# EAGLE design SI1120-sensor (EAGLE 5.06)
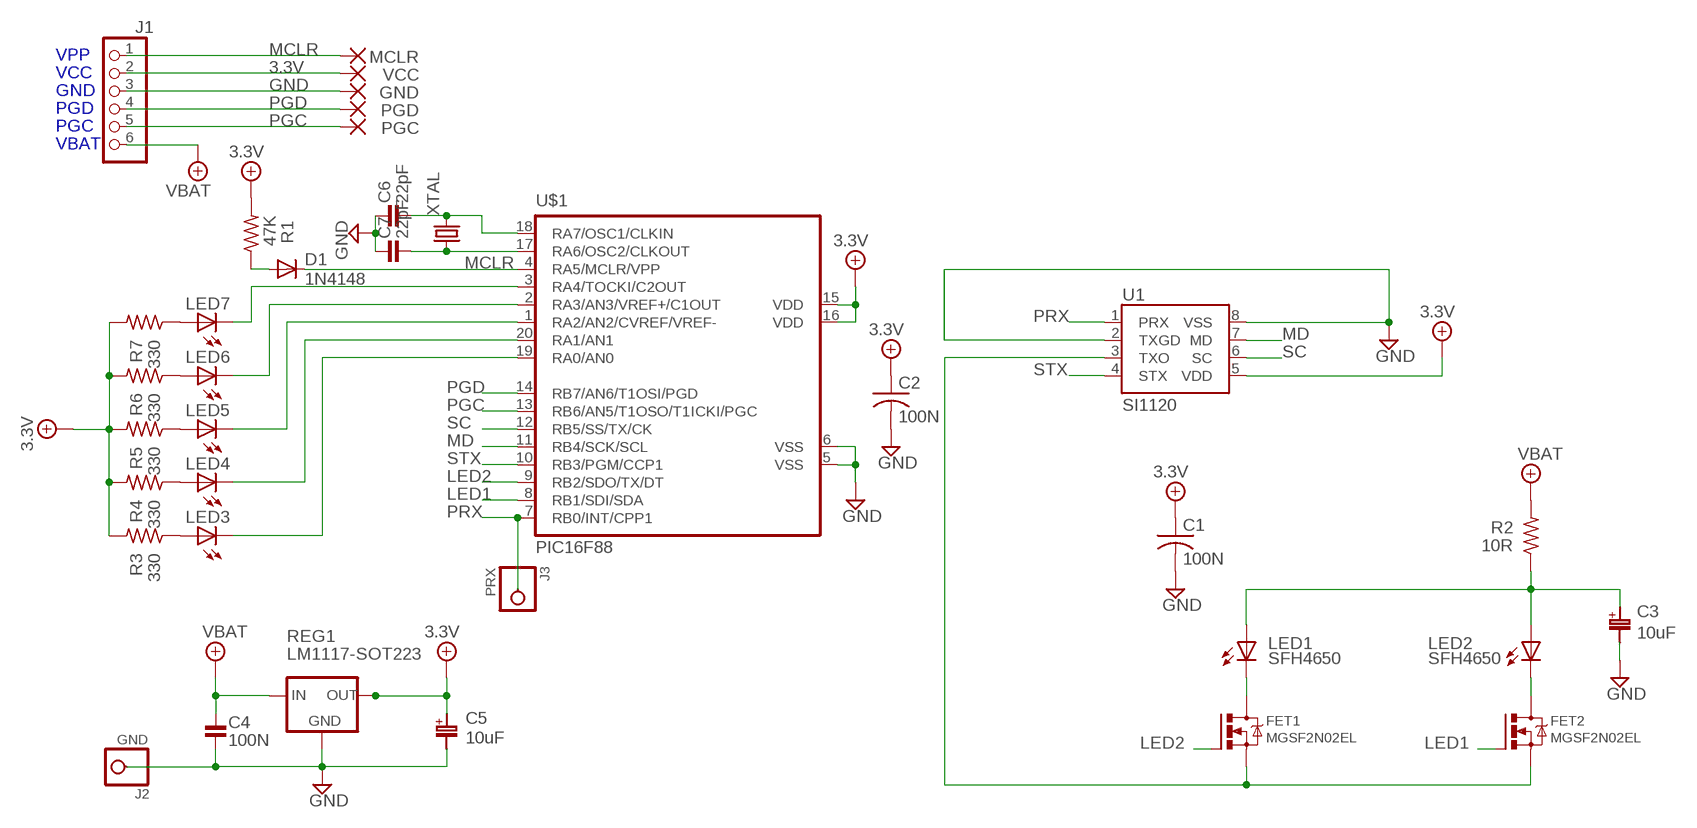
[diagram p0: schematic, sheet 1]

## Parts
C1  100N  C-US050-025X075  [C050-025X075]
C2  100N  C-USC0805  [C0805]
C3  10uF  CAP_POLCT3528-21  [3528-21R]
C4  100N  C-SMD0805  [R0805-AMR]
C5  10uF  CAP_POLCT3528-21  [3528-21R]
C6  22pF  C-SMD0805  [R0805-AMR]
C7  22pF  C-SMD0805  [R0805-AMR]
D1  1N4148  1N4148DO35-7  [DO35-7]
FET1  MGSF2N02EL  [SOT-23-3]
FET2  MGSF2N02EL  [SOT-23-3]
GND  SMD2  [SMD1,27-2,54]
J1  PINHD-1X6  [1X06]
J2  GND  PINHD-1X1  [1X01]
J3  PRX  PINHD-1X1  [1X01]
LED1  SFH4650  [SFH4650]
LED2  SFH4650  [SFH4650]
LED3  LED5MM  [LED5MM]
LED4  LED5MM  [LED5MM]
LED5  LED5MM  [LED5MM]
LED6  LED5MM  [LED5MM]
LED7  LED5MM  [LED5MM]
MCLR  SMD2  [SMD1,27-2,54]
PGC  SMD2  [SMD1,27-2,54]
PGD  SMD2  [SMD1,27-2,54]
R1  47K  R-US_0207/7  [0207/7]
R2  10R  R-SMD0805  [R0805-AMR]
R3  330  R-US_0207/7  [0207/7]
R4  330  R-US_0207/7  [0207/7]
R5  330  R-US_0207/7  [0207/7]
R6  330  R-US_0207/7  [0207/7]
R7  330  R-US_0207/7  [0207/7]
REG1  LM1117-SOT223  [SOT223]
U1  SI1120  [ODFN8-M]
U$1  PIC16F88  [SSOP20]
VCC  SMD2  [SMD1,27-2,54]
XTAL  CRYSTALHC49S  [HC49/S]

## Nets
3.3V [power]: C1.1 C2.1 C5.+ J1.2 R1.2 R3.2 R4.2 R5.2 R6.2 R7.2 REG1.2(OUT) REG1.4(TAB) U1.5(VDD) U$1.15(VDD) U$1.16(VDD) VCC.1(P)
GND [power]: C1.2 C2.2 C3.- C4.2 C5.- C6.1 C7.1 GND.1(P) J1.3 J2.1 REG1.1(GND) U1.2(TXGD) U1.8(VSS) U$1.5(VSS) U$1.6(VSS)
LED1: FET2.1(G) U$1.8(RB1/SDI/SDA)
LED2: FET1.1(G) U$1.9(RB2/SDO/TX/DT)
MCLR: D1.C J1.1 MCLR.1(P) U$1.4(RA5/MCLR/VPP)
MD: U1.7(MD) U$1.11(RB4/SCK/SCL)
N$1: FET1.3(D) LED1.K(C)
N$2: FET2.3(D) LED2.K(C)
N$3 [power]: C3.+ LED1.A LED2.A R2.1
N$4: LED7.A R7.1
N$5: LED6.A R6.1
N$6 [power]: FET1.2(S) FET2.2(S) U1.3(TXO)
N$7: LED5.A R5.1
N$8: LED4.A R4.1
N$9: LED3.A R3.1
N$10: LED7.K(C) U$1.3(RA4/TOCKI/C2OUT)
N$11: D1.A R1.1
N$12: LED6.K(C) U$1.2(RA3/AN3/VREF+/C1OUT)
N$13: LED5.K(C) U$1.1(RA2/AN2/CVREF/VREF-)
N$14: LED4.K(C) U$1.20(RA1/AN1)
N$15: LED3.K(C) U$1.19(RA0/AN0)
N$16: C6.2 U$1.18(RA7/OSC1/CLKIN) XTAL.2
N$17: C7.2 U$1.17(RA6/OSC2/CLKOUT) XTAL.1
PGC: J1.5 PGC.1(P) U$1.13(RB6/AN5/T1OSO/T1ICKI/PGC)
PGD: J1.4 PGD.1(P) U$1.14(RB7/AN6/T1OSI/PGD)
PRX: J3.1 U1.1(PRX) U$1.7(RB0/INT/CPP1)
SC: U1.6(SC) U$1.12(RB5/SS/TX/CK)
STX: U1.4(STX) U$1.10(RB3/PGM/CCP1)
VBAT [power]: C4.1 J1.6 R2.2 REG1.3(IN)

## Notes on the sheet
- VPP
- VCC
- GND
- PGD
- PGC
- VBAT

## Library data of the parts
C1 C2 = rcl:C-US: CAPACITOR, American symbol
C3 C5 = aaron_discrete:CAP_POL
C4 C6 C7 = aaron_discrete:C-SMD: SMD non-polarized capacitor library - AMR
D1 = diode:1N4148: DIODE high speed (Philips)
FET1 FET2 = aaron_discrete:MGSF2N02EL
GND MCLR PGC PGD VCC = wirepad:SMD2: SMD PAD
J1 = aaron_hardware:PINHD-1X6: PIN HEADER
J2 J3 = aaron_hardware:PINHD-1X1
LED1 LED2 = aaron_discrete:SFH4650
LED3-LED7 = aaron_discrete:LED
R1 R3-R7 = resistor:R-US_: RESISTOR, American symbol
R2 = aaron_discrete:R-SMD: SMD Resistor library, AMR
REG1 = aaron_discrete:LM1117-SOT223
U1 = aaron_ic:SI1120: IR/LIGHT SENSOR AMBIENT W/PWM OUT
U$1 = microchip:PIC16F88: FLASH-Based 8-Bit CMOS Microcontroller
XTAL = crystal:CRYSTAL: CRYSTAL

## Net classes
0 default: width 0.152 mm, drill 0.3 mm, clearance 0.152 mm
1 power: width 0.254 mm, drill 0.3 mm, clearance 0.152 mm

## Board
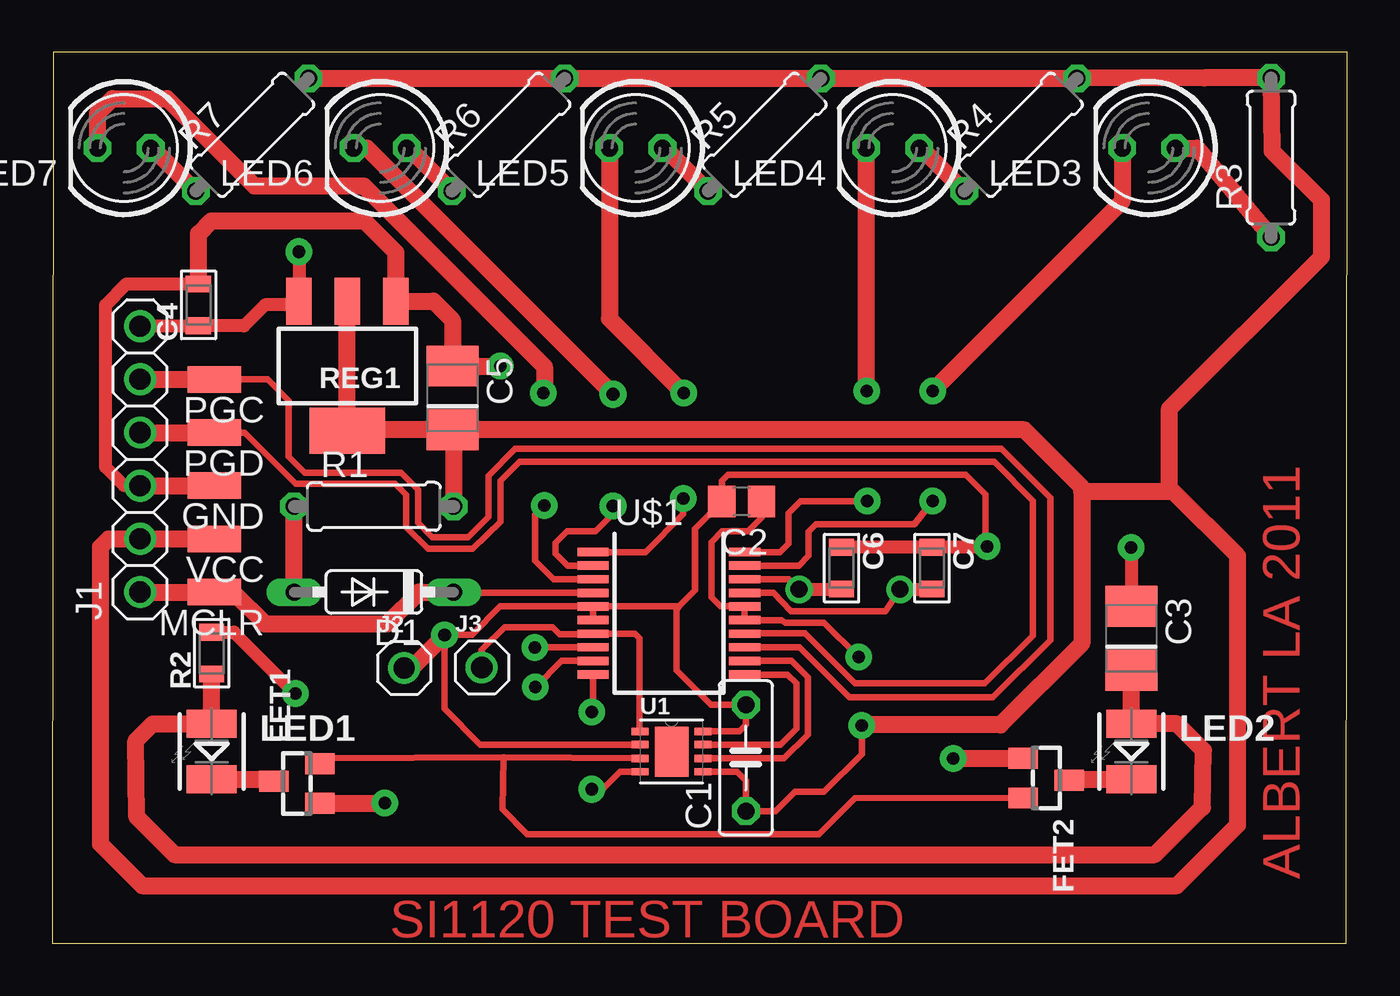
[diagram p1: board, top side]
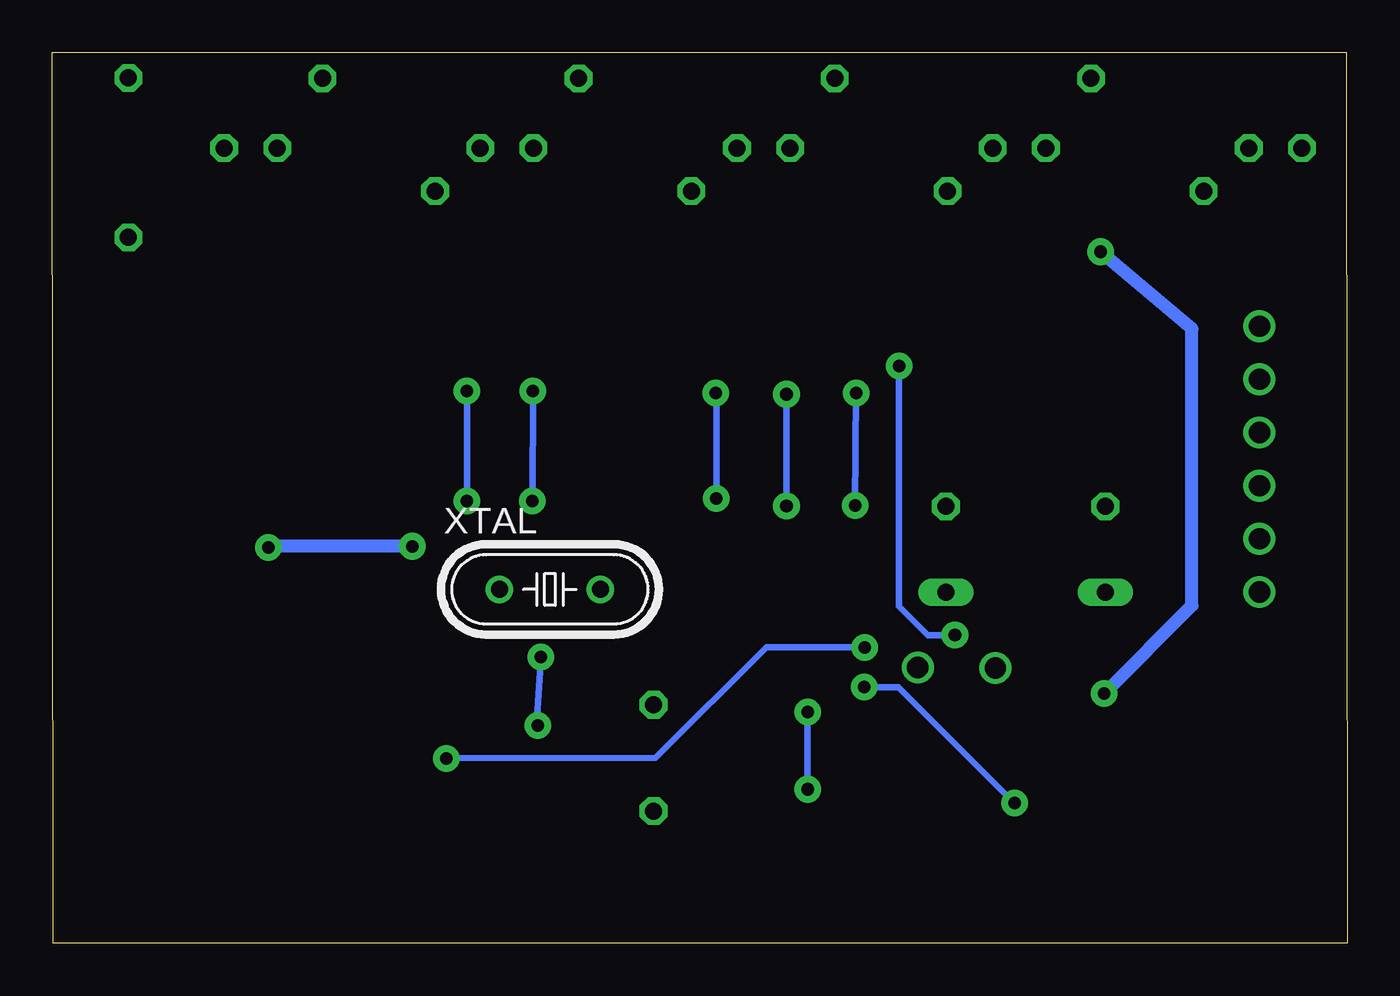
[diagram p2: board, bottom side, seen from below]

Size 61.88 x 42.57 mm. Coordinates in mm from the lower left corner, seen from the top.
Outline: 0,0 61.83,0 61.88,42.57 0.05,42.57 0,0
Copper layers (1*16): Top 0.035mm / dielectric 1.5mm / Bottom 0.035mm
Design rules "default": minimum track width 10mil, minimum drill 24mil, track to track 8mil, track to pad 8mil, pad to pad 8mil, via to via 8mil, smd to smd 8mil, copper to edge 40mil, drill to drill 8mil, minimum pad ring 10mil, minimum via ring 8mil, stop-mask expansion 4mil, vias tented up to drill 0mil, thermal gap 10mil

### Footprints (pad centres in the part's own frame; a part is rotated, then mirrored left to right if it is on the bottom)
C050-025X075 = drill 0.813 octagon: 1 -2.54,0; 2 2.54,0
C0805 = smd 1.3 x 1.5: 1 -0.95,0; 2 0.95,0
3528-21R = smd 1.95 x 2.5: + 1.525,0; - -1.525,0
R0805-AMR = smd 0.8 x 1.2: 1 -1,0; 2 1,0
DO35-7 = drill 0.813 long: A 3.81,0; C -3.81,0
SOT-23-3 = smd 1 x 1.4: 1 -0.95,-1.1; 2 0.95,-1.1; 3 0.1,1.1
SMD1,27-2,54 = smd 1.27 x 2.54: 1 0,0
1X06 = drill 1.016 round: 1 -6.35,0; 2 -3.81,0; 3 -1.27,0; 4 1.27,0; 5 3.81,0; 6 6.35,0
1X01 = drill 1.016 round: 1 0,0
SFH4650 = smd 2.4 x 1.35: A 0,1.325; K 0,-1.325
LED5MM = drill 0.813 octagon: A -1.27,0; K 1.27,0
0207/7 = drill 0.813 octagon: 1 -3.81,0; 2 3.81,0
SOT223 = smd 1.219 x 2.235: 1 -2.311,-3.099; 2 0,-3.099; 3 2.311,-3.099 | smd 3.6 x 2.2: 4 0,3.099
ODFN8-M = smd 0.813 x 0.356: 1 -1.499,0.965; 2 -1.499,0.33; 3 -1.499,-0.33; 4 -1.499,-0.965; 5 1.499,-0.965; 6 1.499,-0.33; 7 1.499,0.33; 8 1.499,0.965 | smd 1.6 x 2.388: 9 0,0
SSOP20 = smd 0.4 x 1.5: 1 -2.925,-3.625; 2 -2.275,-3.625; 3 -1.625,-3.625; 4 -0.975,-3.625; 5 -0.325,-3.625; 6 0.325,-3.625; 7 0.975,-3.625; 8 1.625,-3.625; 9 2.275,-3.625; 10 2.925,-3.625; 11 2.925,3.625; 12 2.275,3.625; 13 1.625,3.625; 14 0.975,3.625; 15 0.325,3.625; 16 -0.325,3.625; 17 -0.975,3.625; 18 -1.625,3.625; 19 -2.275,3.625; 20 -2.925,3.625
HC49/S = drill 0.813 round: 1 -2.413,0; 2 2.413,0

### Placement (x,y rotation side)
C1  33.15,8.86 90 top
C2  32.94,21.11 180 top
C3  51.56,14.58 270 top
C4  6.98,30.51 90 top
C5  19.13,26.06 270 top
C6  37.72,17.93 270 top
C7  42.04,17.93 270 top
D1  15.37,16.79 180 top
FET1  11.68,7.65 90 top
FET2  47.5,7.9 270 top
GND  7.75,21.87 90 top
J1  4.19,23.14 90 top
J2  16.81,13.16 0 top
J3  20.52,13.18 0 top
LED1  7.62,9.17 0 top
LED2  51.56,9.17 0 top
LED3  52.4,38 180 top
LED4  40.16,38 180 top
LED5  27.89,38 180 top
LED6  15.67,38 180 top
LED7  3.43,38 180 top
MCLR  7.75,16.79 90 top
PGC  7.75,26.95 90 top
PGD  7.75,24.41 90 top
R1  15.37,20.88 0 top
R2  7.62,13.87 90 top
R3  58.24,37.54 90 top
R4  46.28,38.63 45 top
R5  34.04,38.63 45 top
R6  21.79,38.63 45 top
R7  9.55,38.63 45 top
REG1  14.1,27.58 180 top
U1  29.59,9.17 0 top
U$1  29.46,15.77 270 top
VCC  7.75,19.33 90 top
XTAL  38.1,16.92 0 bottom

### Tracks (layer width: path | path; a pad name or v marks a point on that pad's centre or on a via)
3.3V  (via drill 0.6 pad 1.27)
  Top 0.305: U1.5 32.72,8.2 33.15,7.77 C1.1 34.57,6.32 35.48,7.24 36.88,7.24 38.68,9.04 v38.68,10.41 | C2.1 33.89,20.33 33.25,19.69 32,19.69 31.5,19.18 31.5,16.54 31.93,16.1 U$1.16 U$1.15 34.46,15.45 34.77,15.44 34.85,15.44 35.03,15.32 36.88,15.32 v38.53,13.69
  Top 0.813: REG1.2 REG1.4 14.15,24.54 C5.+ | C5.+ 46.46,24.54 49.2,21.79 49.2,21.59 | 49.2,21.59 49.2,14.33 45.31,10.44 38.71,10.44 v38.68,10.41 | R1.2 19.18,24.15 C5.+ | 53.32,21.59 53.57,21.59 56.64,18.52 56.64,5.66 53.75,2.77 4.29,2.77 2.31,4.75 2.31,18.95 2.69,19.33 J1.2 VCC.1 | 53.32,21.59 49.2,21.59 | 53.32,21.59 53.39,21.67 53.39,25.55 60.66,32.82 60.66,35.51 58.29,37.85 R3.2 55.04,41.35 R4.2 R5.2 R6.2 R7.2
  Bottom 0.305: v38.53,13.69 38.73,10.46 v38.68,10.41
GND  (via drill 0.6 pad 1.27)
  Top 0.305: U$1.5 U$1.6 | U1.8 32.84,10.13 33.15,10.44 C1.2 31.47,11.4 29.82,13.06 29.82,15.98 29.94,16.1 | U$1.5 29.94,16.1 | 29.94,16.1 30.71,16.87 30.71,19.82 C2.2 31.99,22.11 32.28,22.4 43.66,22.4 44.6,21.46 44.6,19.05 v44.68,18.97 | U$1.5 21.41,16.1 20.07,14.76 18.77,14.76 v18.75,14.73 18.75,11.2 20.45,9.5 U1.2
  Top 0.61: C4.2 3.54,31.51 2.54,30.51 2.54,22.76 3.43,21.87 J1.3 | C6.1 C7.1 44.64,18.93 v44.68,18.97 | v51.56,18.92 C3.-
  Top 0.813: J1.3 GND.1 | v21.41,27.58 18.8,27.58 C5.- 19.13,29.77 18.21,30.68 REG1.1 16.41,33.02 14.91,34.52 7.6,34.52 6.98,33.91 C4.2 | J2.1 17.17,13.16 v18.75,14.73
  Bottom 0.305: v18.75,14.73 20.04,14.73 21.41,16.1 v21.41,27.58
  Bottom 0.61: v44.68,18.97 51.51,18.97 v51.56,18.92
LED1  (via drill 0.6 pad 1.27)
  Top 0.305: U$1.8 v23.06,14.15
  Top 0.813: v43.05,8.84 FET2.1
  Bottom 0.305: v23.06,14.15 27.76,14.15 33.05,8.86 v43.05,8.84
LED2  (via drill 0.6 pad 1.27)
  Top 0.305: U$1.9 24.34,13.5 v23.09,12.24
  Top 0.813: v15.9,6.71 FET1.1
  Bottom 0.305: v23.09,12.24 21.44,12.24 v15.9,6.71
MCLR
  Top 0.305: U$1.4 19.22,16.75 D1.C
  Top 0.813: J1.1 MCLR.1 8.64,16.79 10.16,15.27 16,15.27 17.53,16.79 D1.C
MD
  Top 0.305: U$1.11 35.13,12.85 35.56,12.42 35.56,10.26 34.8,9.5 U1.7
N$1
  Top 0.813: LED1.K 10.48,7.84 FET1.3
N$2
  Top 0.813: LED2.K 48.64,7.84 FET2.3
N$3
  Top 0.813: R2.1 LED1.A 4.8,10.49 3.99,9.68 4.04,6.05 5.84,4.24 52.68,4.24 54.97,6.5 55.02,9.22 53.75,10.49 LED2.A C3.+
N$4
  Top 0.813: LED7.A 4.8,38 R7.1
N$5
  Top 0.813: LED6.A 17.04,38 R6.1
N$6
  Top 0.305: 21.56,8.89 13.03,8.84 FET1.2 | 21.56,8.89 U1.3 | FET2.2 38.35,6.93 36.64,5.22 22.69,5.22 21.51,6.4 21.56,8.89
N$7
  Top 0.813: LED5.A 29.28,38 R5.1
N$8
  Top 0.813: LED4.A 41.53,38 R4.1
N$9
  Top 0.813: LED3.A 54.71,38 R3.1
N$10  (via drill 0.6 pad 1.27)
  Top 0.305: U$1.3 23.95,17.4 23.06,18.29 23.06,20.47 v23.52,20.93
  Top 0.813: LED7.K 2.16,39.65 2.87,40.36 5.49,40.36 9.65,36.2 14.88,36.2 23.52,27.56 23.52,26.34 v23.47,26.29
  Bottom 0.305: v23.52,20.93 v23.47,26.29
N$11
  Top 0.813: D1.A R1.1
N$12  (via drill 0.6 pad 1.27)
  Top 0.305: U$1.2 24.62,18.05 24.05,18.62 24.05,19.15 24.59,19.69 25.96,19.69 26.8,20.52 v26.8,20.9
  Top 0.813: LED6.K 15.04,38 v26.8,26.24
  Bottom 0.305: v26.8,20.9 v26.8,26.24
N$13  (via drill 0.6 pad 1.27)
  Top 0.305: U$1.1 28.35,18.7 30.15,20.5 v30.15,21.26
  Top 0.813: LED5.K 26.62,29.85 v30.17,26.29
  Bottom 0.305: v30.15,21.26 30.15,25.02 v30.17,26.29
N$14  (via drill 0.6 pad 1.27)
  Top 0.305: U$1.20 34.78,18.7 35.18,19.1 35.18,20.55 35.76,21.13 v38.94,21.13
  Top 0.813: LED4.K 38.89,26.42 v38.91,26.39
  Bottom 0.305: v38.94,21.13 v38.91,26.39
N$15  (via drill 0.6 pad 1.27)
  Top 0.305: U$1.19 35.68,18.05 36.14,18.52 36.14,19.66 36.5,20.02 41.2,20.02 v42.06,21.13
  Top 0.813: LED3.K 51.13,35.46 v42.06,26.39
  Bottom 0.305: v42.06,21.13 v42.06,26.39
N$16
  Top 0.305: U$1.18 35.2,17.4 XTAL.2
  Top 0.61: C6.2 35.7,16.93 XTAL.2
N$17
  Top 0.305: U$1.17 34.46,16.75 35.31,15.88 39.8,15.88 XTAL.1
  Top 0.61: C7.2 40.53,16.93 XTAL.1
PGC
  Top 0.305: U$1.13 35.71,14.15 38.1,11.76 39.57,11.76 42.65,11.76 44.96,11.76 47.7,14.48 47.7,21.29 45.36,23.62 22.12,23.62 20.85,22.35 20.85,20.4 19.86,19.41 18.16,19.41 17.47,20.09 17.47,21.67 16.66,22.48 12.06,22.48 11.3,23.24 11.3,25.93 10.29,26.95 PGC.1
  Top 0.813: J1.5 PGC.1
PGD
  Top 0.305: PGD.1 9.2,24.41 11.63,21.97 16.38,21.97 16.92,21.44 16.92,19.89 17.96,18.85 20.09,18.85 21.41,20.14 21.41,22.1 22.33,23.01 45.01,23.01 46.86,21.16 46.86,14.71 44.58,12.42 38.35,12.42 35.97,14.81 U$1.14
  Top 0.813: J1.4 PGD.1
PRX
  Top 0.305: U1.1 28.07,10.16 28.07,14.58 27.85,14.8 U$1.7 25.82,14.78 24.23,14.78 23.9,15.11 21.61,15.11 20.52,14.02 J3.1
SC
  Top 0.305: U1.6 34.98,8.84 36.12,9.98 36.12,12.73 35.33,13.51 33.1,13.51 U$1.12
STX  (via drill 0.6 pad 1.27)
  Top 0.305: U$1.10 25.84,11.11 v25.78,11.05 | v25.78,7.37 26.29,7.37 27.13,8.2 U1.4
  Bottom 0.305: v25.78,7.37 v25.78,11.05
VBAT  (via drill 0.6 pad 1.27)
  Top 0.61: 6.97,29.49 J1.6 | C4.1 9.16,29.51 10.16,30.51 11.61,30.51 | R2.2 8.68,14.87 v11.61,11.94 | v11.79,33.05 REG1.3
  Top 0.813: C4.1 6.97,29.49 | REG1.3 11.61,30.51
  Bottom 0.61: v11.61,11.94 11.61,11.96 7.42,16.15 7.42,29.36 v11.79,33.05

### Text on the board
Top: ALBERT LA 2011 | SI1120 TEST BOARD